# Altium schematic sheet System Block Diagram.SchDoc: Bike It System Architecture
size A3; Author: Madhukar Arora; DrawnBy: Madhukar Arora; SheetNumber: 1; SheetTotal: 4
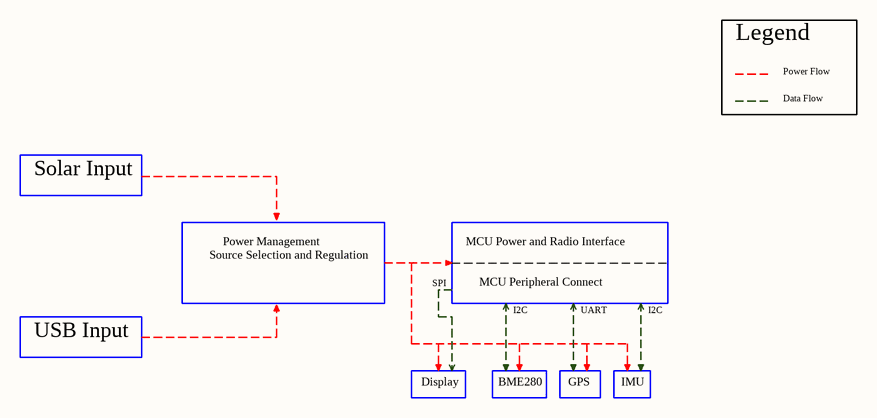
[diagram p0: System Block Diagram.SchDoc]

## Notes on the sheet
- Legend
- Power Flow
- Data Flow
- Solar Input
- Power Management
- MCU Power and Radio Interface
- Source Selection and Regulation
- SPI
- MCU Peripheral Connect
- I2C
- UART
- USB Input
- Display
- BME280
- GPS
- IMU